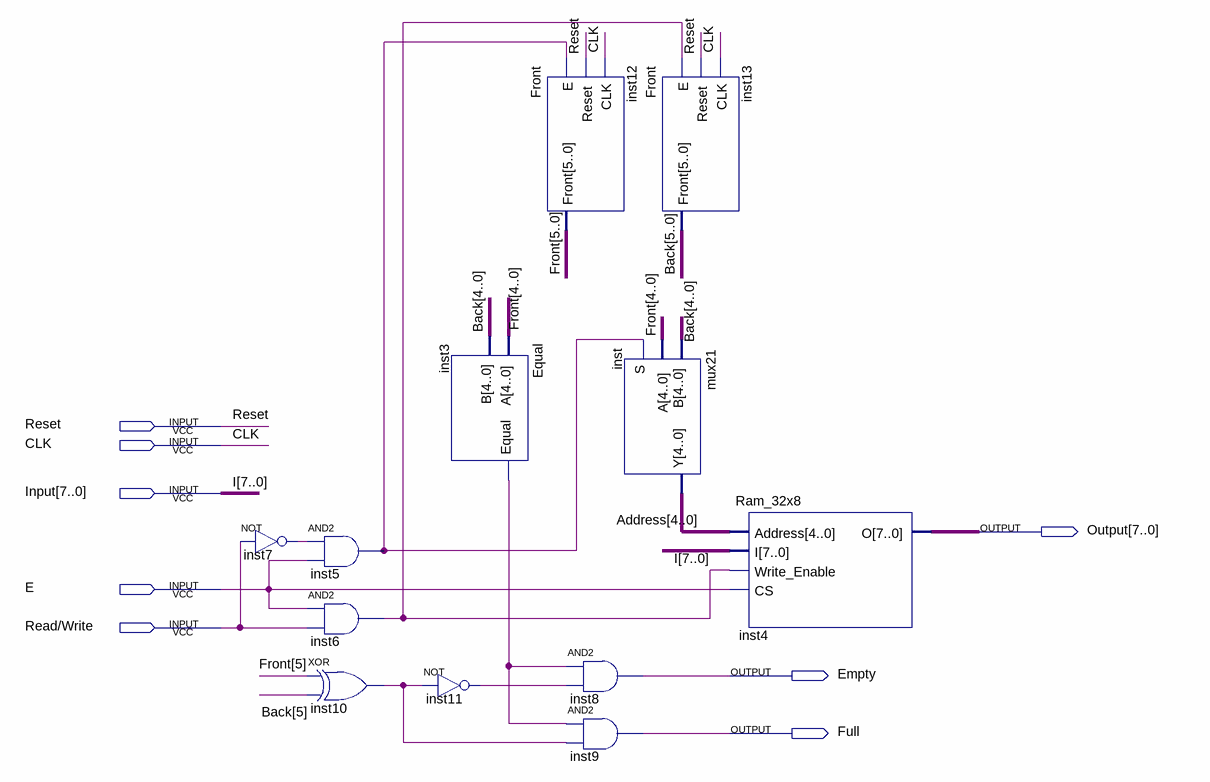
[diagram p0: schematic sheet]
// Quartus schematic FIFO.bdf as structural Verilog: 12 symbols, 8 pins
module FIFO (
  input  Reset,
  input  CLK,
  input  [7:0] Input,
  input  E,
  input  \Read/Write ,
  output [7:0] Output,
  output Empty,
  output Full
);

  wire inst3_equal, inst5_out, inst6_out, inst7_out, inst10_out, inst11_out;
  wire [4:0] Address;
  wire [5:0] Back, Front;

  not inst7 (inst7_out, \Read/Write );
  and inst5 (inst5_out, inst7_out, E);
  and inst6 (inst6_out, E, \Read/Write );
  xor inst10 (inst10_out, Front[5], Back[5]);
  Equal inst3 (.A(Front[4:0]), .B(Back[4:0]), .Equal(inst3_equal));
  not inst11 (inst11_out, inst10_out);
  Front inst12 (.E(inst5_out), .Reset(Reset), .CLK(CLK), .Front(Front));
  mux21 inst (.A(Front[4:0]), .B(Back[4:0]), .S(inst5_out), .Y(Address));
  and inst8 (Empty, inst3_equal, inst11_out);
  and inst9 (Full, inst3_equal, inst10_out);
  Front inst13 (.E(inst6_out), .Reset(Reset), .CLK(CLK), .Front(Back));
  Ram_32x8 inst4 (.Address(Address), .I(Input), .Write_Enable(inst6_out), .CS(E), .O(Output));

  // Other names for the same wires on the sheet: I[7:0] = Input
endmodule
